# Altium schematic sheet Motherboard.SchDoc
size A2; SheetNumber: 1; SheetTotal: 22
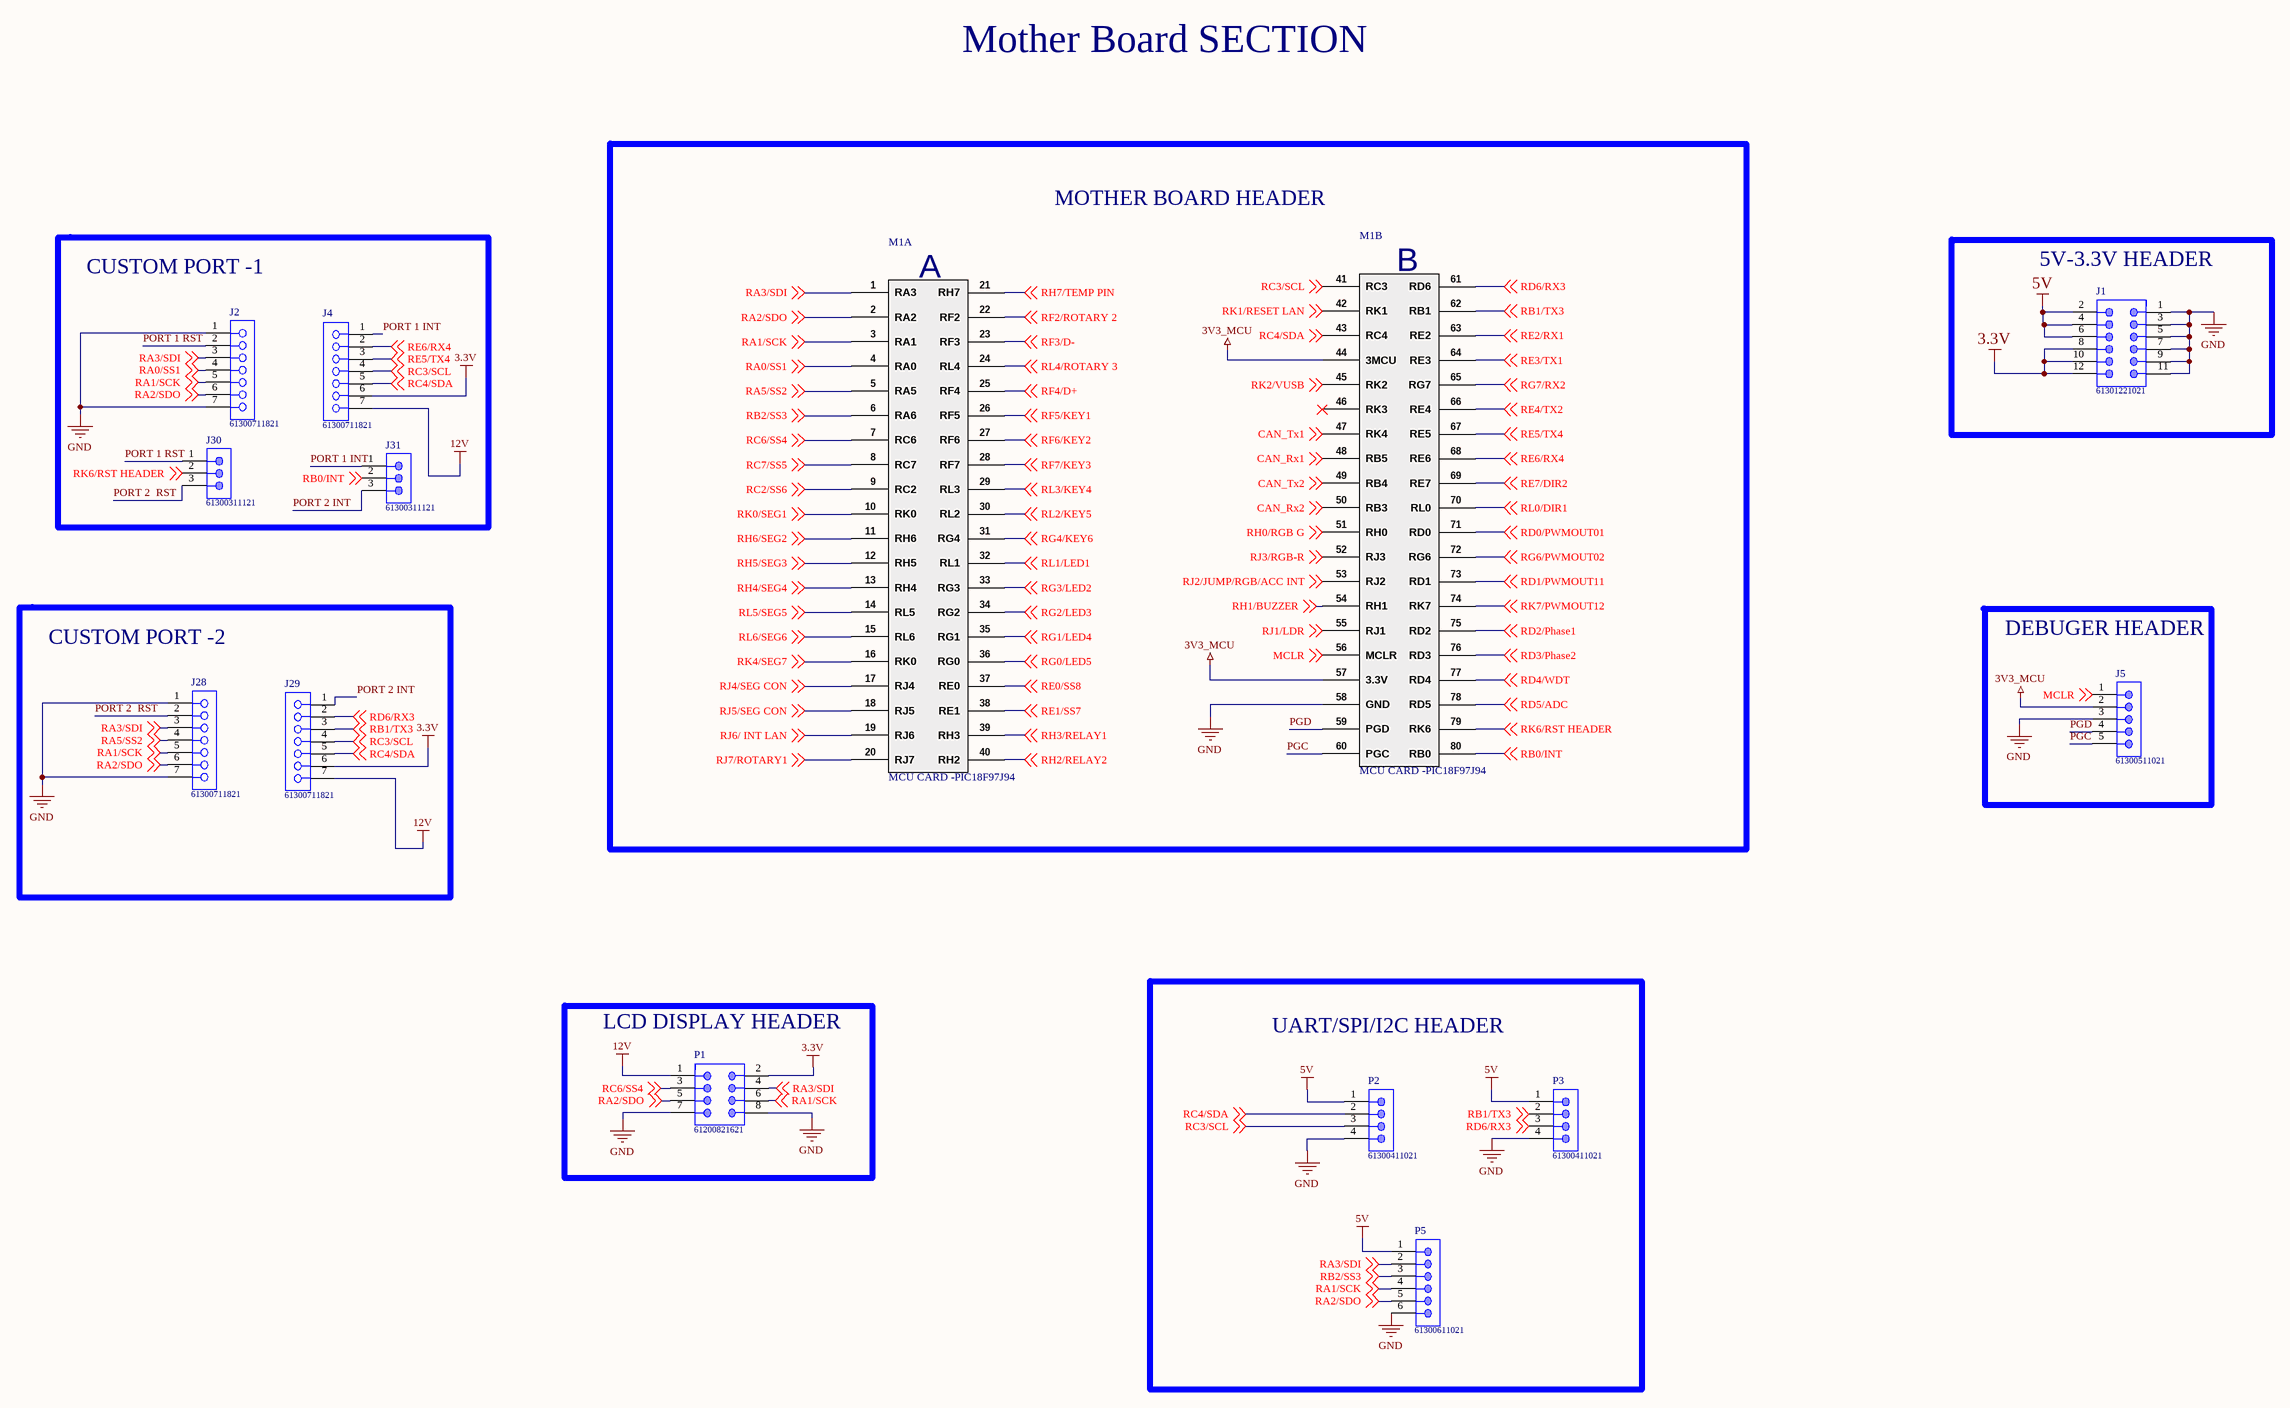
[diagram p0: Motherboard.SchDoc]

## Parts
J1  61301221021  [61301221021]
J2  61300711821  [61300711821]
J4  61300711821  [61300711821]
J5  61300511021  [61300511021]
J28  61300711821  [61300711821]
J29  61300711821  [61300711821]
J30  61300311121  [61300311121]
J31  61300311121  [61300311121]
M1  MCU CARD -PIC18F97J94  [MCU-Card-PIC18f97j94]  (parts A,B of 2)
P1  61200821621  [61200821621]
P2  61300411021  [61300411021]
P3  61300411021  [61300411021]
P5  61300611021  [61300611021]

## Blocks framed on the sheet
MOTHER BOARD HEADER: M1
CUSTOM PORT -1: J2 J4 J30 J31
5V-3.3V HEADER: J1
CUSTOM PORT -2: J28 J29
DEBUGER HEADER: J5
LCD DISPLAY HEADER: P1
UART/SPI/I2C HEADER: P2 P3 P5

## Nets
3.3V: J1.8 J1.10 J1.12 J4.6 J29.6 P1.2
3V3_MCU: J5.2 M1.44(3MCU) M1.57(3.3V)
5V: J1.2 J1.4 J1.6 P2.1 P3.1 P5.1
12V: J4.7 J29.7 P1.1
GND: J1.1 J1.3 J1.5 J1.7 J1.9 J1.11 J2.1 J2.7 J5.3 J28.1 J28.7 M1.58(GND) P1.7 P1.8 P2.4 P3.4 P5.6
CAN_Rx1: M1.48(RB5) ; off-sheet CAN_Rx1
CAN_Rx2: M1.50(RB3) ; off-sheet CAN_Rx2
CAN_Tx1: M1.47(RK4) ; off-sheet CAN_Tx1
CAN_Tx2: M1.49(RB4) ; off-sheet CAN_Tx2
MCLR: J5.1 M1.56(MCLR) ; off-sheet MCLR
PGC: J5.5 M1.60(PGC)
PGD: J5.4 M1.59(PGD)
PORT 1 INT: J4.1 J31.1
PORT 1 RST: J2.2 J30.1
PORT 2  RST: J28.2 J30.3
PORT 2 INT: J29.1 J31.3
RA0/SS1: J2.4 M1.4(RA0) ; off-sheet RA0/SS1
RA1/SCK: J2.5 J28.5 M1.3(RA1) P1.6 P5.4 ; off-sheet RA1/SCK
RA2/SDO: J2.6 J28.6 M1.2(RA2) P1.5 P5.5 ; off-sheet RA2/SDO
RA3/SDI: J2.3 J28.3 M1.1(RA3) P1.4 P5.2 ; off-sheet RA3/SDI
RA5/SS2: J28.4 M1.5(RA5) ; off-sheet RA5/SS2
RB0/INT: J31.2 M1.80(RB0) ; off-sheet RB0/INT
RB1/TX3: J29.3 M1.62(RB1) P3.2 ; off-sheet RB1/TX3
RB2/SS3: M1.6(RA6) P5.3 ; off-sheet RB2/SS3
RC2/SS6: M1.9(RC2) ; off-sheet RC2/SS6
RC3/SCL: J4.4 J29.4 M1.41(RC3) P2.3 ; off-sheet RC3/SCL
RC4/SDA: J4.5 J29.5 M1.43(RC4) P2.2 ; off-sheet RC4/SDA
RC6/SS4: M1.7(RC6) P1.3 ; off-sheet RC6/SS4
RC7/SS5: M1.8(RC7) ; off-sheet RC7/SS5
RD0/PWMOUT01: M1.71(RD0) ; off-sheet RD0/PWMOUT01
RD1/PWMOUT11: M1.73(RD1) ; off-sheet RD1/PWMOUT11
RD2/Phase1: M1.75(RD2) ; off-sheet RD2/Phase1
RD3/Phase2: M1.76(RD3) ; off-sheet RD3/Phase2
RD4/WDT: M1.77(RD4) ; off-sheet RD4/WDT
RD5/ADC: M1.78(RD5) ; off-sheet RD5/ADC
RD6/RX3: J29.2 M1.61(RD6) P3.3 ; off-sheet RD6/RX3
RE0/SS8: M1.37(RE0) ; off-sheet RE0/SS8
RE1/SS7: M1.38(RE1) ; off-sheet RE1/SS7
RE2/RX1: M1.63(RE2) ; off-sheet RE2/RX1
RE3/TX1: M1.64(RE3) ; off-sheet RE3/TX1
RE4/TX2: M1.66(RE4) ; off-sheet RE4/TX2
RE5/TX4: J4.3 M1.67(RE5) ; off-sheet RE5/TX4
RE6/RX4: J4.2 M1.68(RE6) ; off-sheet RE6/RX4
RE7/DIR2: M1.69(RE7) ; off-sheet RE7/DIR2
RF2/ROTARY 2: M1.22(RF2) ; off-sheet RF2/ROTARY 2
RF3/D-: M1.23(RF3) ; off-sheet RF3/D-
RF4/D+: M1.25(RF4) ; off-sheet RF4/D+
RF5/KEY1: M1.26(RF5) ; off-sheet RF5/KEY1
RF6/KEY2: M1.27(RF6) ; off-sheet RF6/KEY2
RF7/KEY3: M1.28(RF7) ; off-sheet RF7/KEY3
RG0/LED5: M1.36(RG0) ; off-sheet RG0/LED5
RG1/LED4: M1.35(RG1) ; off-sheet RG1/LED4
RG2/LED3: M1.34(RG2) ; off-sheet RG2/LED3
RG3/LED2: M1.33(RG3) ; off-sheet RG3/LED2
RG4/KEY6: M1.31(RG4) ; off-sheet RG4/KEY6
RG6/PWMOUT02: M1.72(RG6) ; off-sheet RG6/PWMOUT02
RG7/RX2: M1.65(RG7) ; off-sheet RG7/RX2
RH0/RGB G: M1.51(RH0) ; off-sheet RH0/RGB G
RH1/BUZZER: M1.54(RH1) ; off-sheet RH1/BUZZER
RH2/RELAY2: M1.40(RH2) ; off-sheet RH2/RELAY2
RH3/RELAY1: M1.39(RH3) ; off-sheet RH3/RELAY1
RH4/SEG4: M1.13(RH4) ; off-sheet RH4/SEG4
RH5/SEG3: M1.12(RH5) ; off-sheet RH5/SEG3
RH6/SEG2: M1.11(RH6) ; off-sheet RH6/SEG2
RH7/TEMP PIN: M1.21(RH7) ; off-sheet RH7/TEMP PIN
RJ1/LDR: M1.55(RJ1) ; off-sheet RJ1/LDR
RJ2/JUMP/RGB/ACC INT: M1.53(RJ2) ; off-sheet RJ2/JUMP/RGB/ACC INT
RJ3/RGB-R: M1.52(RJ3) ; off-sheet RJ3/RGB-R
RJ4/SEG CON: M1.17(RJ4) ; off-sheet RJ4/SEG CON
RJ5/SEG CON: M1.18(RJ5) ; off-sheet RJ5/SEG CON
RJ6/ INT LAN: M1.19(RJ6) ; off-sheet RJ6/ INT LAN
RJ7/ROTARY1: M1.20(RJ7) ; off-sheet RJ7/ROTARY1
RK0/SEG1: M1.10(RK0) ; off-sheet RK0/SEG1
RK1/RESET LAN: M1.42(RK1) ; off-sheet RK1/RESET LAN
RK2/VUSB: M1.45(RK2) ; off-sheet RK2/VUSB
RK4/SEG7: M1.16(RK0) ; off-sheet RK4/SEG7
RK6/RST HEADER: J30.2 M1.79(RK6) ; off-sheet RK6/RST HEADER
RK7/PWMOUT12: M1.74(RK7) ; off-sheet RK7/PWMOUT12
RL0/DIR1: M1.70(RL0) ; off-sheet RL0/DIR1
RL1/LED1: M1.32(RL1) ; off-sheet RL1/LED1
RL2/KEY5: M1.30(RL2) ; off-sheet RL2/KEY5
RL3/KEY4: M1.29(RL3) ; off-sheet RL3/KEY4
RL4/ROTARY 3: M1.24(RL4) ; off-sheet RL4/ROTARY 3
RL5/SEG5: M1.14(RL5) ; off-sheet RL5/SEG5
RL6/SEG6: M1.15(RL6) ; off-sheet RL6/SEG6

Not connected (* = marked no-connect by the designer): M1 46(RK3)*

## Notes on the sheet
- Mother Board SECTION
- (in symbol MCU CARD -PIC18F97J94, part A) A
- (in symbol MCU CARD -PIC18F97J94, part B) B

## Library data of the parts
J1 = 61301221021: WR-PHD Pin Header, THT, pitch 2.54mm, Dual Row, Angled, 12pin; Pin Number: 12; Gender: Male; Rated Current: 3A; Working Voltage: 250VAC; Withstanding Voltage: 500VAC; Contact Resistance: 20mOhm; ComponentLink1Description: Manufacturer; ComponentLink1URL: http://www.we-online.de; ComponentLink2Description: Datasheet; ComponentLink2URL: https://katalog.we-online.de/em/datasheet/6130xx21021.pdf; Part Number: 61301221021; Published Date: June 2019; Publisher: Wurth Elektronik; Pitch: 2.54mm; Operating Temperature: -40 to +105degC; Mounting Technology: THT; Packaging: Bag; Row Number: Dual; Orientation: Angled
J2 J4 J28 J29 = 61300711821: WR-PHD Socket Header, THT, pitch 2.54mm, Single Row, Vertical, 7pin; Pin Number: 7; Gender: Female; Rated Current: 3A; Working Voltage: 250VAC; Withstanding Voltage: 500VAC; Contact Resistance: 20mOhm; ComponentLink1Description: Manufacturer; ComponentLink1URL: http://www.we-online.de; ComponentLink2Description: Datasheet; ComponentLink2URL: https://katalog.we-online.de/em/datasheet/6130xx11821.pdf; Part Number: 61300711821; Published Date: June 2019; Publisher: Wurth Elektronik; Pitch: 2.54mm; Operating Temperature: -40 to +125degC; Mounting Technology: THT; Packaging: Tray; Row Number: Single; Orientation: Vertical
J5 = 61300511021: WR-PHD Pin Header, THT, pitch 2.54mm, Single Row, Angled, 5pin; Pin Number: 5; Gender: Male; Rated Current: 3A; Working Voltage: 250VAC; Withstanding Voltage: 500VAC; Contact Resistance: 20mOhm; ComponentLink1Description: Manufacturer; ComponentLink1URL: http://www.we-online.de; ComponentLink2Description: Datasheet; ComponentLink2URL: https://katalog.we-online.de/em/datasheet/6130xx11021.pdf; Part Number: 61300511021; Published Date: June 2019; Publisher: Wurth Elektronik; Pitch: 2.54mm; Operating Temperature: -40 to +105degC; Mounting Technology: THT; Packaging: Bag; Row Number: Single; Orientation: Angled
J30 J31 = 61300311121: WR-PHD Pin Header, THT, pitch 2.54mm, Single Row, Vertical, 3pin; Pin Number: 3; Gender: Male; Rated Current: 3A; Working Voltage: 250VAC; Withstanding Voltage: 500VAC; Contact Resistance: 20mOhm; ComponentLink1Description: Manufacturer; ComponentLink1URL: http://www.we-online.de; ComponentLink2Description: Datasheet; ComponentLink2URL: https://katalog.we-online.de/em/datasheet/6130xx11121.pdf; Part Number: 61300311121; Published Date: June 2019; Publisher: Wurth Elektronik; Pitch: 2.54mm; Operating Temperature: -40 to +105degC; Mounting Technology: THT; Packaging: Bag; Row Number: Single; Orientation: Vertical
M1 = MCU CARD -PIC18F97J94: MCU CARD -PIC18F97J94 FOR mother board
P1 = 61200821621: Male Box Header WR-BHD, THT, Vertical, pitch 2.54 mm, 8 pins; Pitch: 2.54 mm; Working Voltage: 250 VAC; Withstanding Voltage: 500 VAC; Contact Resistance: 20 mOhm; Pin Number: 8; ComponentLink1Description: Manufacturer; ComponentLink1URL: http://www.we-online.de; ComponentLink2Description: Datasheet; ComponentLink2URL: https://katalog.we-online.de/em/datasheet/6120xx21621.pdf; Part Number: 61200821621; Published Date: August 2018; Publisher: Wurth Elektronik; Operating Temperature: -40 to 125 degC; Packaging: Tray; Gender: Male; Mounting Technology: THT; Orientation: Vertical
P2 P3 = 61300411021: WR-PHD Pin Header, THT, pitch 2.54mm, Single Row, Angled, 4pin; Pin Number: 4; Gender: Male; Rated Current: 3A; Working Voltage: 250VAC; Withstanding Voltage: 500VAC; Contact Resistance: 20mOhm; ComponentLink1Description: Manufacturer; ComponentLink1URL: http://www.we-online.de; ComponentLink2Description: Datasheet; ComponentLink2URL: https://katalog.we-online.de/em/datasheet/6130xx11021.pdf; Part Number: 61300411021; Published Date: June 2019; Publisher: Wurth Elektronik; Pitch: 2.54mm; Operating Temperature: -40 to +105degC; Mounting Technology: THT; Packaging: Bag; Row Number: Single; Orientation: Angled
P5 = 61300611021: WR-PHD Pin Header, THT, pitch 2.54mm, Single Row, Angled, 6pin; Pin Number: 6; Gender: Male; Rated Current: 3A; Working Voltage: 250VAC; Withstanding Voltage: 500VAC; Contact Resistance: 20mOhm; ComponentLink1Description: Manufacturer; ComponentLink1URL: http://www.we-online.de; ComponentLink2Description: Datasheet; ComponentLink2URL: https://katalog.we-online.de/em/datasheet/6130xx11021.pdf; Part Number: 61300611021; Published Date: June 2019; Publisher: Wurth Elektronik; Pitch: 2.54mm; Operating Temperature: -40 to +105degC; Mounting Technology: THT; Packaging: Bag; Row Number: Single; Orientation: Angled